# Altium project SLEEPTRACK2_PHASE4.PrjPcb
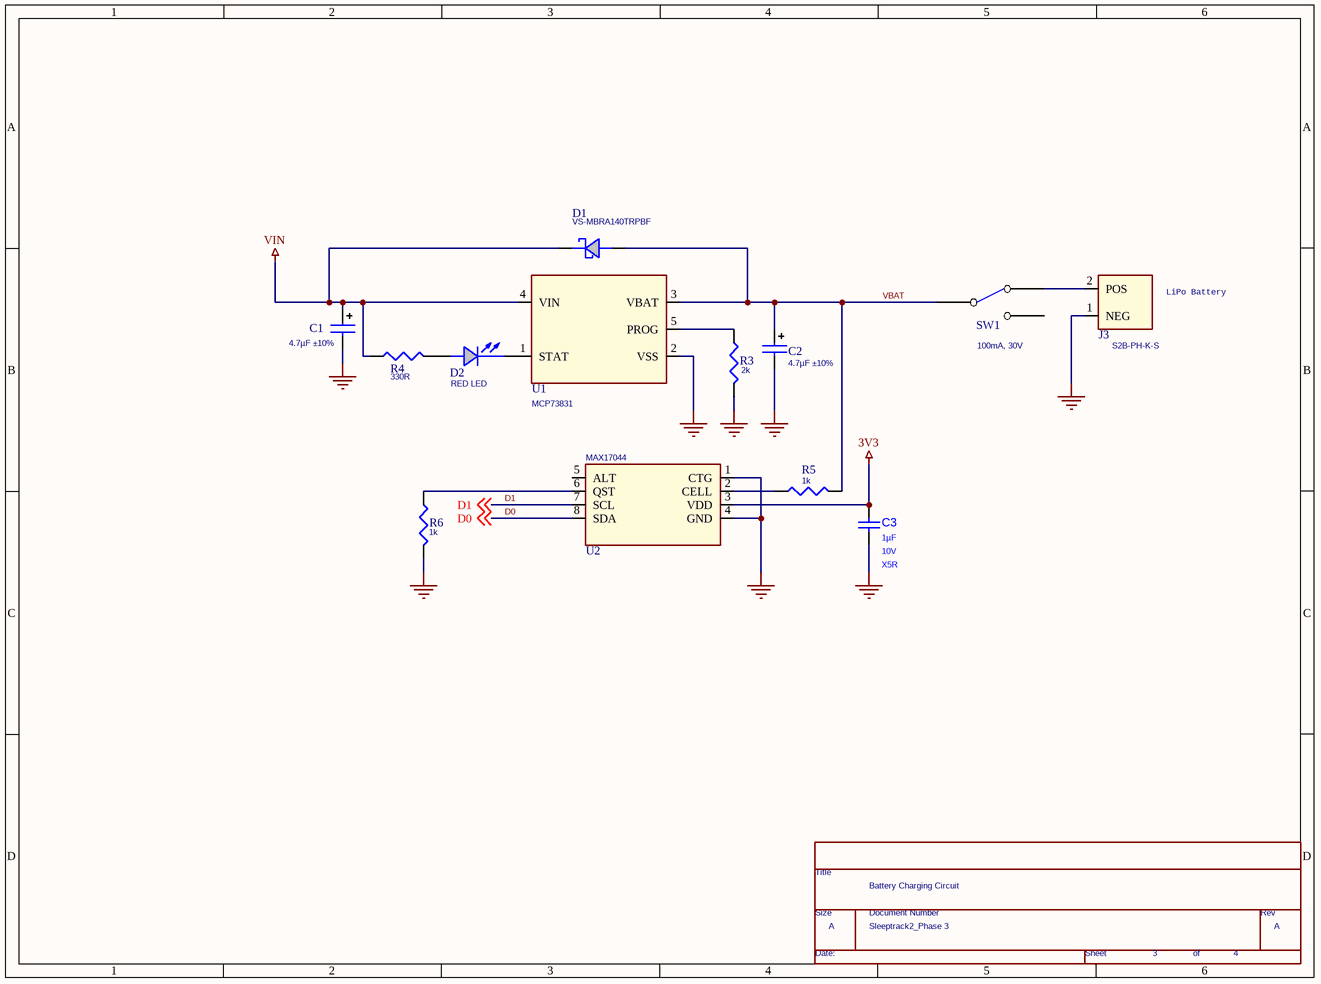
[diagram p0: P03_Battery Circuit.SchDoc]
5 sheets, 27 parts. Net scope: global (net labels, ports and power ports of the same name join across sheets).
Board file: SLEEPTRACK2_PHASE4.PcbDoc
Sheets:
  P03_Battery Circuit.SchDoc
  P02_Photon.SchDoc
  P04_Connectors.SchDoc
  P06_Audio .SchDoc
  P09_DRV2605L Motor Driver.SchDoc

## Sheet P03_Battery Circuit.SchDoc
size 246 x 182 mm

### Parts
(Parts that share a designator on the sheet are numbered #1, #2 ... from top to bottom, then left to right.)
*#1  Doc: Sleeptrack2_Phase 3  RevCode: A  Title: Battery Charging Circuit  Page Number: 3  Page Count: 4  (hidden comment: TitleBlock0)  (graphical)
C1  4.7µF ±10%  [CAPCP1206]
C2  4.7µF ±10%  [CAPCP1206]
C3  ValueDisplayed: 1µF  Value2: 10V  TempCo: X5R  [0402]  (hidden comment: GRM155R61A105KE15D)
D1  VS-MBRA140TRPBF  [D0-214AC]
D2  RED LED  [LED0402N]
J3  S2B-PH-K-S  [S2B-PH-K-S]
R3  2k  [RESC402N]
R4  330R  [RESC402N]
R5  1k  [RESC402N]
R6  1k  [RESC402N]
SW1  100mA, 30V  [SS12DH2]
U1  MCP73831  [SOT95P270X145-5N]
U2  MAX17044  [SON50P300X100_HS-9M]

### Nets
3V3: C3.1 U2.3(VDD)  [project net Photon_3V3]
GND: C1.2 C2.2 C3.2 J3.1(NEG) R3.2 R6.2 U1.2(VSS) U2.1(CTG) U2.4(GND)  [project net Photon_GND]
VIN: C1.1 D1.2(CATHODE) R4.1 U1.4(VIN)  [project net Photon_VIN]
D0: U2.8(SDA) ; off-sheet D0
D1: U2.7(SCL) ; off-sheet D1
VBAT: C2.1 D1.1(ANODE) R5.2 SW1.1(COMMON) U1.3(VBAT)
NetD2_1: D2.1(CATHODE) U1.1(STAT)
NetD2_2: D2.2(ANODE) R4.2
NetJ3_2: J3.2(POS) SW1.3(NO)
NetR3_1: R3.1 U1.5(PROG)
NetR5_1: R5.1 U2.2(CELL)
NetR6_1: R6.1 U2.6(QST)

Not connected (* = marked no-connect by the designer): SW1 2(NC); U2 5(ALT)

### Notes on the sheet
- LiPo Battery
- (in symbol TitleBlock0) Title; Size; Document Number; Rev; Date:; Sheet; of

### Library data of the parts
C1 C2 = 4.7µF ±10% Molded Tantalum Capacitors 6.3V 1206 (3216 Metric) 6 Ohm: T491A475K006AT
C3 = GRM155R61A105KE15D: CAP, CERM, 1 µF, 10 V, +/- 10%, X5R, 0402; Manufacturer: MuRata; Polarized: N; CompType: Capacitor; Value: 1uF; U/M: EA; Cap_F: 0.000001; Tolerance_%: 10; Value1: Unknown; TaMin_C: -55; TaMax_C: 85; AEC Category: Q200; SymbolVersion: 2008-07-09; PartNumber: GRM155R61A105KE15D; PackageReference: 0402; RoHS: Y; VDC_V: 10; MountType: SMT; Technology: Ceramic; Cap_Case: 0402; Published: 2008-06-19; Publisher: Texas Instruments; LatestRevisionDate: 2016-01-22; ComponentLink1Description: Datasheet link; ComponentLink1URL: http://search.murata.co.jp/Ceramy/PnsearchViewAction.do?HnOFG=ON&HnNFG=ON&SEL_CNT=50&sLang=en&sKey=GRM155R61A105KE15D&x=9&y=9&search=startwith; Supplier 1: Digi-Key; Supplier Part Number 1: 490-3890-1-ND; Supplier 2: Mouser; Supplier Part Number 2: 81-GRM155R61A105KE15; Supplier 3: Farnell; Supplier Part Number 3: 1735523; AEC Qualified: ?
D1 = VS-MBRA140TRPBF: Diode Schottky 40V 1A Surface Mount SMA
D2 = VLMS1500-GS08: Red 631nm LED Indication - Discrete 2V 0402 (1005 Metric)
J3 = S2B-PH-K-S: 2 Positions Header, Shrouded Connector 0.079" (2.00mm) Through Hole, Right Angle Tin
R3 = RC0402FR-072KL: RES SMD 2K OHM 1% 1/16W 0402
R4 = RC0402FR-07330RL: RES SMD 330R OHM 1% 1/16W 0402
R5 R6 = RC0402FR-071KL: RES SMD 1K OHM 1% 1/16W 0402
SW1 = SS12SDH2: Slide Switch SPDT Through Hole, Right Angle
U1 = MCP73831: Charger IC Lithium-Ion/Polymer SOT-23-5
U2 = MAX17044: Battery Battery Monitor IC Lithium-Ion/Polymer 8-TDFN (2x3)
*#1 = TitleBlock0: Page Create Date: March  8, 1995; Page Size: A

## Sheet P02_Photon.SchDoc
size 246 x 182 mm
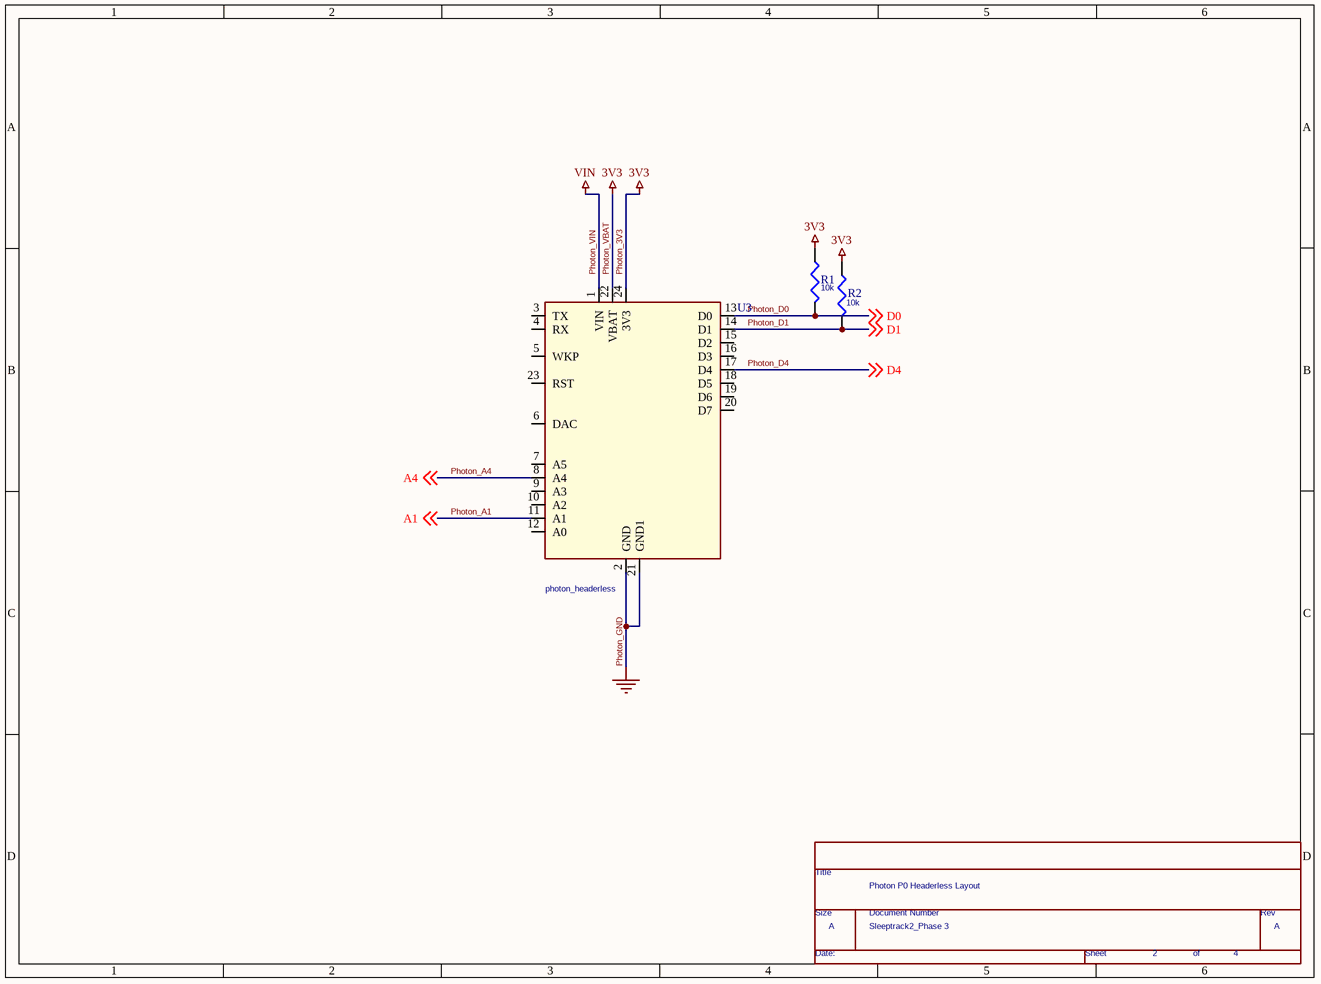
[diagram p1: P02_Photon.SchDoc]

### Parts
(Parts that share a designator on the sheet are numbered #1, #2 ... from top to bottom, then left to right.)
*#2  Doc: Sleeptrack2_Phase 3  RevCode: A  Title: Photon P0 Headerless Layout  Page Number: 2  Page Count: 4  (hidden comment: TitleBlock0)  (graphical)
R1  10k  [RESC402N]
R2  10k  [RESC402N]
U3  photon_headerless  [Photon P0 - duplicate]

### Nets
Photon_3V3: R1.1 R2.1 U3.22(VBAT) U3.24(3V3)  [also labelled 3V3, Photon_VBAT]
Photon_GND: U3.2(GND) U3.21(GND1)  [also labelled GND]
Photon_VIN: U3.1(VIN)  [also labelled VIN]
A4: U3.8(A4) ; off-sheet A4  [also labelled Photon_A4]
D0: R1.2 U3.13(D0) ; off-sheet D0  [also labelled Photon_D0]
D1: R2.2 U3.14(D1) ; off-sheet D1  [also labelled Photon_D1]
Photon_A1: U3.11(A1) ; off-sheet A1  [also labelled A1]
Photon_D4: U3.17(D4) ; off-sheet D4  [also labelled D4]

Not connected (* = marked no-connect by the designer): U3 3(TX) 4(RX) 5(WKP) 6(DAC) 7(A5) 9(A3) 10(A2) 12(A0) 15(D2) 16(D3) 18(D5) 19(D6) 20(D7) 23(RST)

### Notes on the sheet
- (in symbol TitleBlock0) Title; Size; Document Number; Rev; Date:; Sheet; of

### Library data of the parts
R1 R2 = RC0402FR-0710KL: RES SMD 10K OHM 1% 1/16W 0402
*#2 = TitleBlock0: Page Create Date: March  8, 1995; Page Size: A

## Sheet P04_Connectors.SchDoc
size 246 x 182 mm
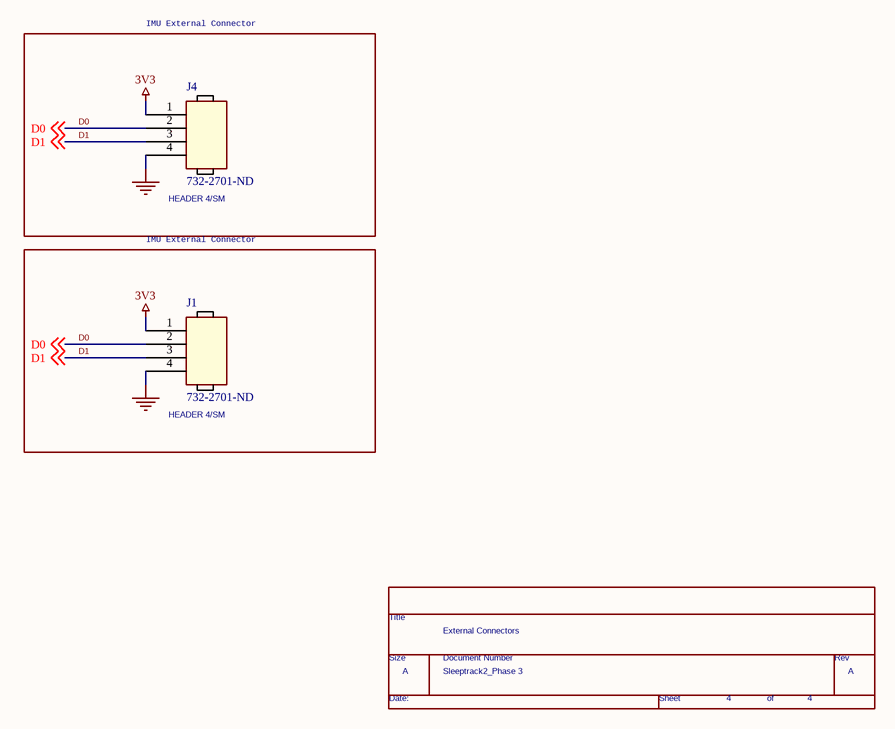
[diagram p2: P04_Connectors.SchDoc]

### Parts
(Parts that share a designator on the sheet are numbered #1, #2 ... from top to bottom, then left to right.)
*#3  Doc: Sleeptrack2_Phase 3  RevCode: A  Title: External Connectors  Page Number: 4  (hidden comment: TitleBlock0)  (graphical)
J1  HEADER 4/SM  Supplier Part Number 1: 732-2701-ND  [61900411021]
J4  HEADER 4/SM  Supplier Part Number 1: 732-2701-ND  [61900411021]

### Blocks framed on the sheet
IMU External Connector: J4
IMU External Connector: J1

### Nets
3V3: J1.1 J4.1  [project net Photon_3V3]
GND: J1.4 J4.4  [project net Photon_GND]
D0: J1.2 J4.2 ; off-sheet D0
D1: J1.3 J4.3 ; off-sheet D1

### Notes on the sheet
- (in symbol TitleBlock0) Title; Size; Document Number; Rev; Date:; Sheet; of

### Library data of the parts
J1 J4 = HEADER 4/SM: 61900411021; Manufacturer: Wurth Electronics Inc.; Shrouding: Shrouded - 1 Wall; Material Flammability Rating: UL94 V-0; Description: HEADER 4POS PIN R/A 2.54MM T/H; Style: Board to Cable/Wire; Pitch - Mating: 0.100" (2.54mm); Current Rating: 3A; Voltage Rating: 250V; Number of Positions Loaded: All; Number of Positions: 4; Contact Length - Post: 0.134" (3.40mm); Contact Length - Mating: 0.300" (7.62mm); Supplier 1: Digi-Key; Connector Type: Header; Operating Temperature: -40°C ~ 105°C; Contact Type: Male Pin; Features: -; Contact Finish - Post: Tin; Manufacturer Part Number: 61900411021; Category: Connectors, Interconnects; Fastening Type: Friction Lock; Insulation Color: Beige; Insulation Material: Polyamide (PA66), Nylon 6/6; Contact Shape: Square; Contact Finish - Mating: Tin; Contact Finish Thickness - Mating: -; Number of Rows: 1; Packaging: Bulk; Supplier: Digi-Key; Ingress Protection: -; Insulation Height: 0.228" (5.80mm); Termination: Solder; Mated Stacking Heights: -; Applications: -; Overall Contact Length: -; Row Spacing - Mating: -; Part Status: Active; Contact Finish Thickness - Post: -; Mounting Type: Through Hole, Right Angle; RoHS: RoHS Compliant; Contact Material: Copper Alloy
*#3 = TitleBlock0: Page Create Date: March  8, 1995; Page Size: A; Page Count: 4

## Sheet P06_Audio .SchDoc
size 246 x 182 mm
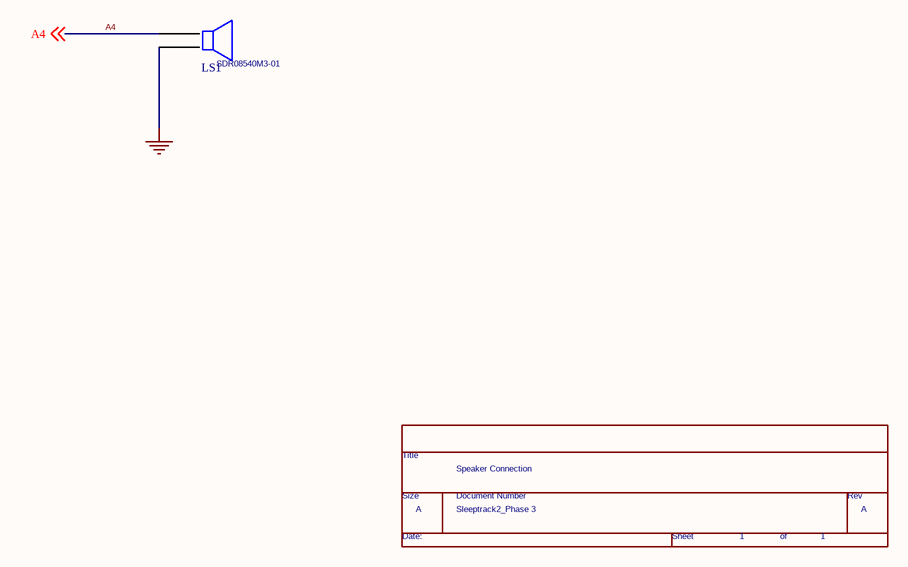
[diagram p3: P06_Audio .SchDoc]

### Parts
(Parts that share a designator on the sheet are numbered #1, #2 ... from top to bottom, then left to right.)
*#4  Doc: Sleeptrack2_Phase 3  RevCode: A  Title: Speaker Connection  Page Number: 1  (hidden comment: TitleBlock0)  (graphical)
LS1  SDR08540M3-01  [SDR08540M3-01]

### Nets
GND: LS1.2  [project net Photon_GND]
A4: LS1.1 ; off-sheet A4

### Notes on the sheet
- (in symbol TitleBlock0) Title; Size; Document Number; Rev; Date:; Sheet; of

### Library data of the parts
LS1 = SDR08540M3-01: Speakers & Transducers 88dB 85mA 3volts 2670Hz
*#4 = TitleBlock0: Page Create Date: March  8, 1995; Page Size: A; Page Count: 1

## Sheet P09_DRV2605L Motor Driver.SchDoc
size A
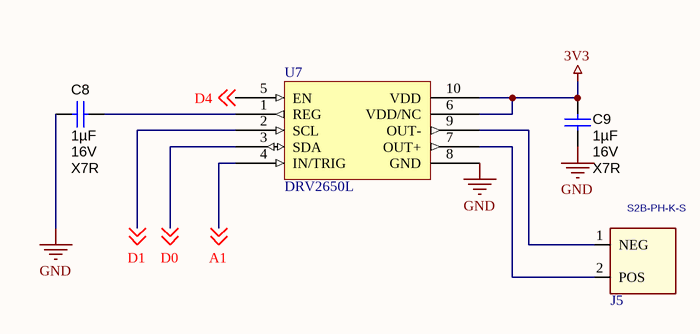
[diagram p4: P09_DRV2605L Motor Driver.SchDoc]

### Parts
C8  ValueDisplayed: 1µF  Value2: 16V  TempCo: X7R  [0603]  (hidden comment: C1608X7R1C105K)
C9  ValueDisplayed: 1µF  Value2: 16V  TempCo: X7R  [0603]  (hidden comment: C1608X7R1C105K)
J5  S2B-PH-K-S  [S2B-PH-K-S]
U7  DRV2650L  [DGS0010A_N]

### Nets
3V3: C9.1 U7.6(VDD/NC) U7.10(VDD)  [project net Photon_3V3]
GND: C8.2 C9.2 U7.8(GND)  [project net Photon_GND]
A1: U7.4(IN/TRIG) ; off-sheet A1  [project net Photon_A1]
D0: U7.3(SDA) ; off-sheet D0
D1: U7.2(SCL) ; off-sheet D1
D4: U7.5(EN) ; off-sheet D4  [project net Photon_D4]
NetC8_1: C8.1 U7.1(REG)
NetJ5_1: J5.1(NEG) U7.9(OUT-)
NetJ5_2: J5.2(POS) U7.7(OUT+)

### Library data of the parts
C8 C9 = C1608X7R1C105K: CAP, CERM, 1 µF, 16 V, +/- 10%, X7R, 0603; Manufacturer: TDK; Polarized: N; CompType: Capacitor; Value: 1uF; U/M: EA; Cap_F: 0.000001; Tolerance_%: 10; ESR_ohm: 0.0057; Value1: 0.0057 ohm; VDC_V: 16; TaMin_C: -55; TaMax_C: 125; SymbolVersion: 2008-07-09; PartNumber: C1608X7R1C105K; PackageReference: 0603; RoHS: Y; MountType: SMT; Technology: Ceramic; Cap_Case: 0603; Published: 2008-06-19; Publisher: Texas Instruments; LatestRevisionDate: 2014-09-22; ComponentLink1Description: Datasheet link; ComponentLink1URL: http://www.tdk.co.jp/tefe02/e412_c.pdf; Supplier 1: Digi-Key; Supplier Part Number 1: 445-1604-1-ND; Supplier 2: Farnell; Supplier Part Number 2: 1907343
J5 = S2B-PH-K-S: as J3 on sheet P03_Battery Circuit

## Nets that join several sheets
Photon_3V3: P03_Battery Circuit (C3.1 U2.3), P02_Photon (R1.1 R2.1 U3.22 U3.24), P04_Connectors (J1.1 J4.1), P09_DRV2605L Motor Driver (C9.1 U7.6 U7.10)
Photon_GND: P03_Battery Circuit (9 pins), P02_Photon (U3.2 U3.21), P04_Connectors (J1.4 J4.4), P06_Audio  (LS1.2), P09_DRV2605L Motor Driver (C8.2 C9.2 U7.8)
Photon_VIN: P03_Battery Circuit (C1.1 D1.2 R4.1 U1.4), P02_Photon (U3.1)
A4: P02_Photon (U3.8), P06_Audio  (LS1.1)
D0: P03_Battery Circuit (U2.8), P02_Photon (R1.2 U3.13), P04_Connectors (J1.2 J4.2), P09_DRV2605L Motor Driver (U7.3)
D1: P03_Battery Circuit (U2.7), P02_Photon (R2.2 U3.14), P04_Connectors (J1.3 J4.3), P09_DRV2605L Motor Driver (U7.2)
Photon_A1: P02_Photon (U3.11), P09_DRV2605L Motor Driver (U7.4)
Photon_D4: P02_Photon (U3.17), P09_DRV2605L Motor Driver (U7.5)